# EAGLE design RunnersHighEA_Button (EAGLE 9.5.0)
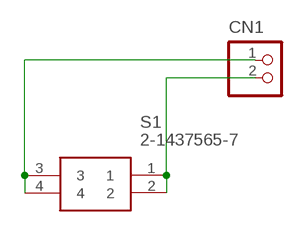
[diagram p0: schematic, sheet 1]

## Parts
CN1  S2B-PH-SM4-TB  [S2B-PH-SM4-TB]
S1  2-1437565-7  [TE-6MM-TACT-SWITCH-SMT]

## Nets
N$1: CN1.2 S1.1 S1.2
N$2: CN1.1 S1.3 S1.4

## Library data of the parts
CN1 = jst-ph:S2B-PH-*: Wire-to-Board 2.0mm pitch side mount connector Source: http://www.jst-mfg.com/product/pdf/jpn/PH.pdf http://www.jst-mfg.com/product/detail.php?series=199
S1 = SamacSys_Parts:2-1437565-7: 6x6mm SMD tactile switch,4.3mm H 1.6N Black Button Tactile Switch, SPST-NO 50 mA @ 12 V ac 0.7mm Source: Datasheet <http://uk.rs-online.com/web/p/products/4791491>; DESCRIPTION: 6x6mm SMD tactile switch,4.3mm H 1.6N Black Button Tactile Switch, SPST-NO 50 mA @ 12 V ac 0.7mm; HEIGHT: mm; MANUFACTURER_NAME: TE Connectivity; MANUFACTURER_PART_NUMBER: 2-1437565-7; RS_PART_NUMBER: 4791491P; RS_PRICE-STOCK: http://uk.rs-online.com/web/p/products/4791491P

## Board
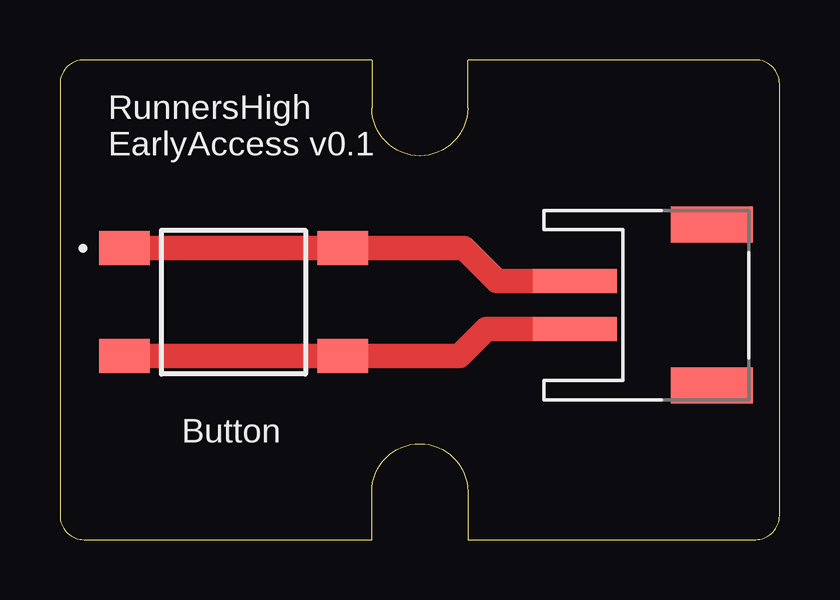
[diagram p1: board, top side]

Size 30 x 20 mm. Coordinates in mm from the lower left corner, seen from the top.
Outline: 13,20 1,20 arc90 0,19 0,1 arc90 1,0 13,0 13,2 arc-180 17,2 17,0 29,0 arc90 30,1 30,19 arc90 29,20 17,20 17,18 arc-180 13,18 13,20
Copper layers (1*16): Top 0.035mm / dielectric 1.5mm / Bottom 0.035mm
Design rules "default": minimum track width 6mil, minimum drill 0.35mm, track to track 6mil, track to pad 6mil, pad to pad 6mil, via to via 6mil, smd to smd 6mil, copper to edge 40mil, drill to drill 6mil, minimum pad ring 10mil, minimum via ring 8mil, stop-mask expansion 4mil, vias tented up to drill 0mil, thermal gap 10mil

### Footprints (pad centres in the part's own frame; a part is rotated, then mirrored left to right if it is on the bottom)
S2B-PH-SM4-TB = smd 1 x 3.5: 1 1,-1; 2 -1,-1 | smd 1.5 x 3.4: S1 -3.35,4.7; S2 3.35,4.7
TE-6MM-TACT-SWITCH-SMT = smd 1.4 x 2.1: 1 2.25,4.55; 2 2.25,-4.55; 3 -2.25,4.55; 4 -2.25,-4.55

### Placement (x,y rotation side)
CN1  22.48,9.78 270 top
S1  7.24,9.91 90 top

### Tracks (layer width: path | path; a pad name or v marks a point on that pad's centre or on a via)
N$1
  Top 1.016: S1.1 S1.2 16.84,12.16 18.22,10.78 CN1.2
N$2
  Top 1.016: CN1.1 17.78,8.78 16.66,7.66 S1.4 S1.3

### Text on the board
tPlace: RunnersHigh / EarlyAccess v0.1 | Button